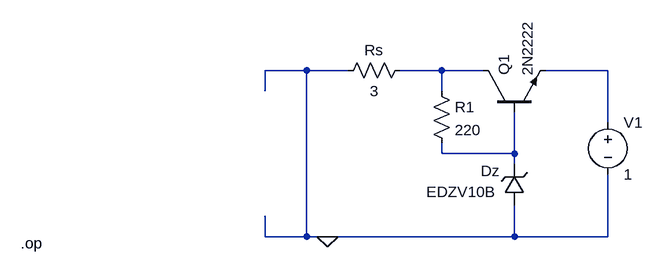
[diagram p0: schematic Draft2.asc]
Draft2.asc, the LTspice schematic file:
Version 4
SHEET 1 880 680
WIRE 80 0 16 0
WIRE 144 0 80 0
WIRE 288 0 224 0
WIRE 352 0 288 0
WIRE 544 0 448 0
WIRE 16 32 16 0
WIRE 288 32 288 0
WIRE 544 80 544 0
WIRE 288 128 288 112
WIRE 400 128 400 64
WIRE 400 128 288 128
WIRE 400 144 400 128
WIRE 16 256 16 224
WIRE 80 256 80 0
WIRE 80 256 16 256
WIRE 112 256 80 256
WIRE 400 256 400 208
WIRE 400 256 112 256
WIRE 544 256 544 160
WIRE 544 256 400 256
FLAG 112 256 0
SYMBOL res 240 -16 R90
WINDOW 0 0 56 VBottom 2
WINDOW 3 32 56 VTop 2
SYMATTR InstName Rs
SYMATTR Value 3
SYMBOL res 272 16 R0
SYMATTR InstName R1
SYMATTR Value 220
SYMBOL npn2 352 64 R270
SYMATTR InstName Q1
SYMATTR Value 2N2222
SYMBOL zener 416 208 R180
WINDOW 0 38 53 Left 2
WINDOW 3 45 21 Left 2
SYMATTR InstName Dz
SYMATTR Value EDZV10B
SYMBOL voltage 544 64 R0
WINDOW 123 0 0 Left 0
WINDOW 39 0 0 Left 0
SYMATTR InstName V1
SYMATTR Value 1
TEXT -360 266 Left 2 !.op

The netlist it stands for:
* Draft2.asc
Rs N001 0 3
R1 N001 N003 220
Q1 N001 N003 N002 0 2N2222
Dz 0 N003 EDZV10B
V1 N002 0 1
.model D D
.lib standard.dio
.model NPN NPN
.model PNP PNP
.lib standard.bjt
.op
.backanno
.end